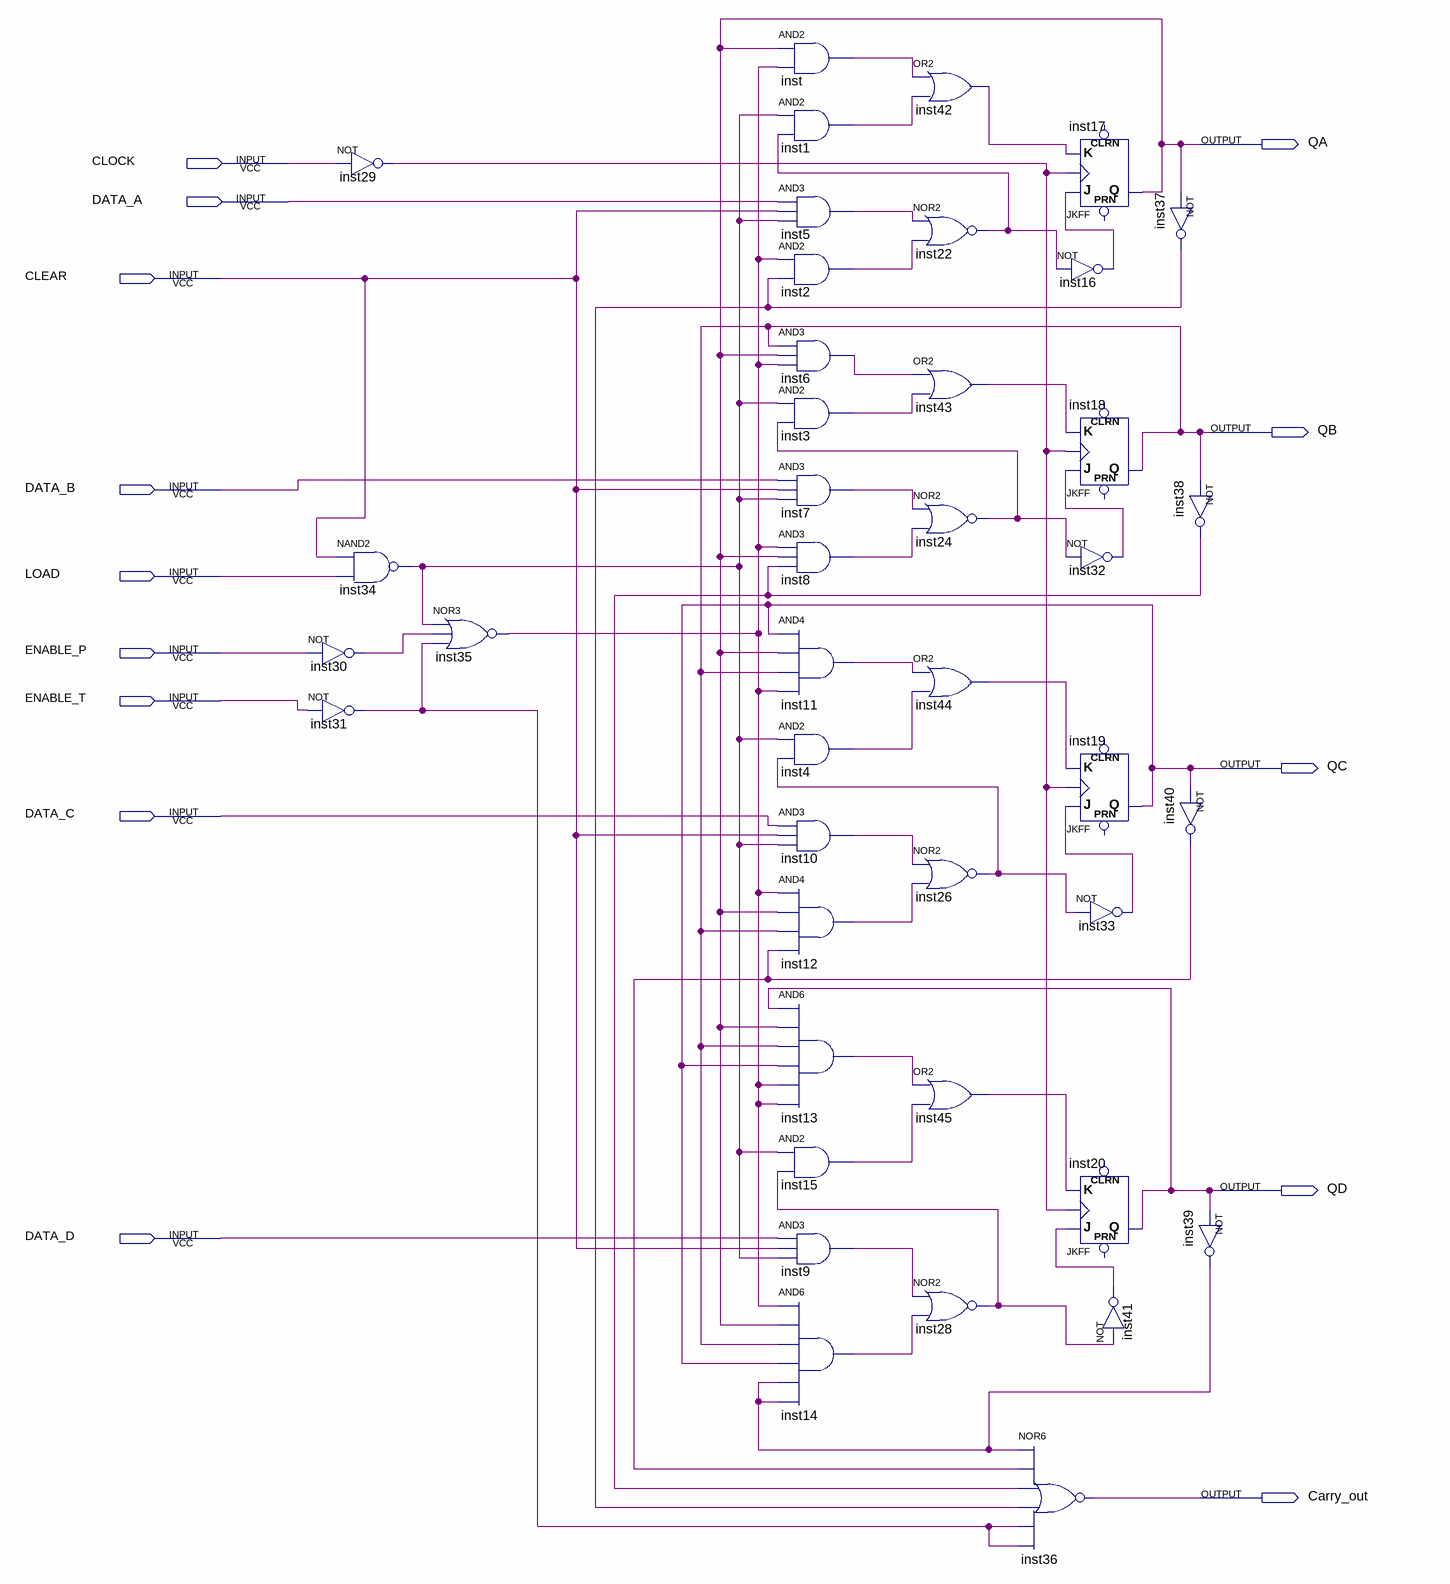
[diagram p0: schematic sheet]
// Quartus schematic CI74LS161.bdf as structural Verilog: 42 symbols, 14 pins
module CI74LS161 (
  input  CLOCK,
  input  DATA_A,
  input  CLEAR,
  input  DATA_B,
  input  LOAD,
  input  ENABLE_P,
  input  ENABLE_T,
  input  DATA_C,
  input  DATA_D,
  output QA,
  output QB,
  output QC,
  output QD,
  output Carry_out
);

  wire inst1_out, inst2_out, inst3_out, inst4_out, inst5_out, inst6_out, inst7_out, inst8_out, inst9_out,
       inst10_out, inst11_out, inst12_out, inst13_out, inst14_out, inst15_out, inst16_out, inst22_out,
       inst24_out, inst26_out, inst28_out, inst29_out, inst30_out, inst31_out, inst32_out, inst33_out,
       inst34_out, inst35_out, inst37_out, inst38_out, inst39_out, inst40_out, inst41_out, inst42_out,
       inst43_out, inst44_out, inst45_out, inst_out;

  not inst29 (inst29_out, CLOCK);
  nand inst34 (inst34_out, CLEAR, LOAD);
  not inst30 (inst30_out, ENABLE_P);
  not inst31 (inst31_out, ENABLE_T);
  nor inst35 (inst35_out, inst34_out, inst30_out, inst31_out);
  and inst (inst_out, QA, inst35_out);
  and inst1 (inst1_out, inst34_out, inst22_out);
  and inst5 (inst5_out, DATA_A, CLEAR, inst34_out);
  and inst2 (inst2_out, inst35_out, inst37_out);
  and inst6 (inst6_out, QB, QA, inst35_out);
  and inst3 (inst3_out, inst34_out, inst24_out);
  and inst7 (inst7_out, DATA_B, CLEAR, inst34_out);
  and inst8 (inst8_out, inst35_out, QA, inst38_out);
  and inst11 (inst11_out, QC, QA, QB, inst35_out);
  and inst4 (inst4_out, inst34_out, inst26_out);
  and inst10 (inst10_out, DATA_C, CLEAR, inst34_out);
  and inst12 (inst12_out, inst35_out, QA, QB, inst40_out);
  and inst13 (inst13_out, QD, QA, QB, QC, inst35_out, inst35_out);
  and inst15 (inst15_out, inst34_out, inst28_out);
  and inst9 (inst9_out, DATA_D, CLEAR, inst34_out);
  and inst14 (inst14_out, inst35_out, QA, QB, QC, inst39_out, inst39_out);
  or inst42 (inst42_out, inst_out, inst1_out);
  nor inst22 (inst22_out, inst5_out, inst2_out);
  or inst43 (inst43_out, inst6_out, inst3_out);
  nor inst24 (inst24_out, inst7_out, inst8_out);
  or inst44 (inst44_out, inst11_out, inst4_out);
  nor inst26 (inst26_out, inst10_out, inst12_out);
  or inst45 (inst45_out, inst13_out, inst15_out);
  nor inst28 (inst28_out, inst9_out, inst14_out);
  JKFF inst17 (.K(inst42_out), .J(inst16_out), .CLK(inst29_out), .Q(QA));  // open: PRN, CLRN
  not inst16 (inst16_out, inst22_out);
  JKFF inst18 (.K(inst43_out), .J(inst32_out), .CLK(inst29_out), .Q(QB));  // open: PRN, CLRN
  not inst32 (inst32_out, inst24_out);
  JKFF inst19 (.K(inst44_out), .J(inst33_out), .CLK(inst29_out), .Q(QC));  // open: PRN, CLRN
  JKFF inst20 (.K(inst45_out), .J(inst41_out), .CLK(inst29_out), .Q(QD));  // open: PRN, CLRN
  nor inst36 (Carry_out, inst39_out, inst40_out, inst38_out, inst37_out, inst31_out, inst31_out);
  not inst33 (inst33_out, inst26_out);
  not inst41 (inst41_out, inst28_out);
  not inst37 (inst37_out, QA);
  not inst38 (inst38_out, QB);
  not inst40 (inst40_out, QC);
  not inst39 (inst39_out, QD);
endmodule
